# Altium schematic sheet RELAY.SchDoc
size A
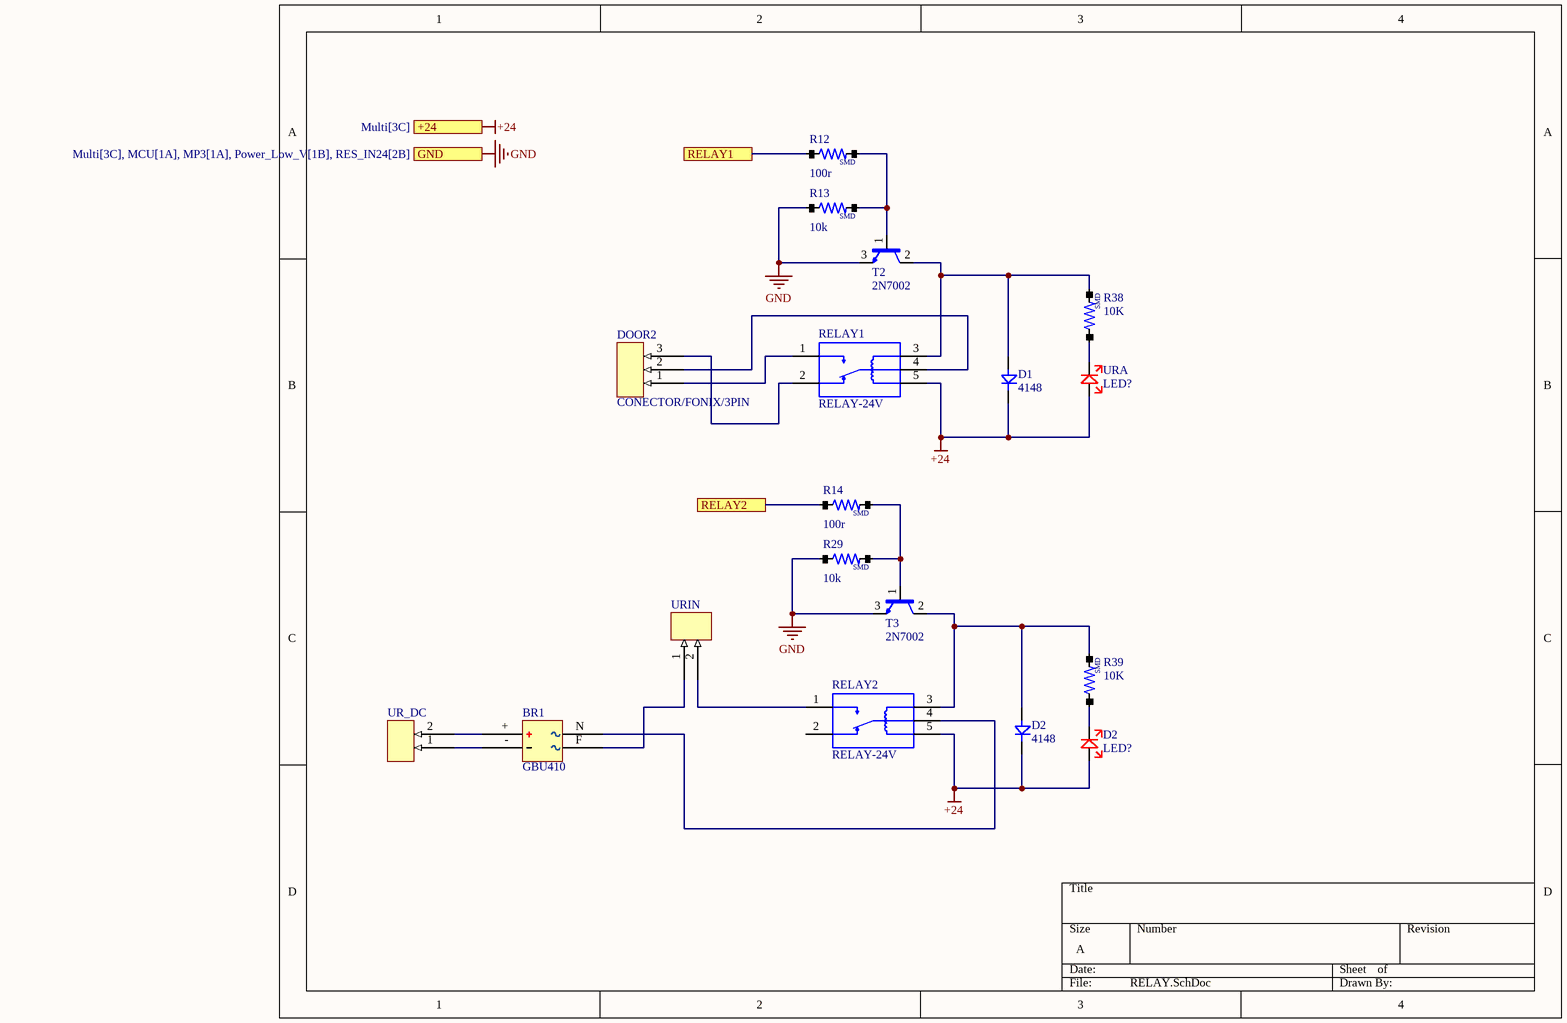
[diagram p0: RELAY.SchDoc]

## Parts
(Parts that share a designator on the sheet are numbered #1, #2 ... from top to bottom, then left to right.)
BR1  GBU410  [BRIDGE_GBU410]
D1  4148  [mini_melf]
D2#1  4148  [mini_melf]
D2#2  LED?  [LED/0805]
DOOR2  CONECTOR/FONIX/3PIN  [CONECTOR/FONIX/3PIN]
R12  100r  [RES/0603]
R13  10k  [RES/0603]
R14  100r  [RES/0603]
R29  10k  [RES/0603]
R38  10K  [RES/0603]
R39  10K  [RES/0603]
RELAY1  RELAY-24V  [RELAY-5V]
RELAY2  RELAY-24V  [RELAY-5V]
T2  2N7002  [SOT23]
T3  2N7002  [SOT23]
UR_DC  (no value)  [CONECTOR/FONIX/2PIN]
URA  LED?  [LED/0805]
URIN  (no value)  [CONECTOR/FONIX/2PIN]

## Ports
+24 (see Multi[3C]), GND (see Multi[3C], MCU[1A], MP3[1A], Power_Low_V[1B], RES_IN24[2B]), RELAY1, RELAY2

## Nets
+24: D1.K D2#1.K D2#2.A RELAY1.5(C2) RELAY2.5(C2) URA.A ; port +24
GND: R13.1 R29.1 T2.3(E) T3.3(E) ; port GND
RELAY1: R12.1 ; port RELAY1
RELAY2: R14.1 ; port RELAY2
NetBR1_+: BR1.+ UR_DC.2
NetBR1_-: BR1.- UR_DC.1
NetBR1_F: BR1.F URIN.1
NetBR1_N: BR1.N RELAY2.4(C)
NetD1_A: D1.A R38.2 RELAY1.3(C1) T2.2(C)
NetD2#1_A: D2#1.A R39.2 RELAY2.3(C1) T3.2(C)
NetD2#2_K: D2#2.K R39.1
NetDOOR2_1: DOOR2.1 RELAY1.1(NO)
NetDOOR2_2: DOOR2.2 RELAY1.4(C)
NetDOOR2_3: DOOR2.3 RELAY1.2(NC)
NetR12_2: R12.2 R13.2 T2.1(B)
NetR14_2: R14.2 R29.2 T3.1(B)
NetR38_1: R38.1 URA.K
NetRELAY2_1: RELAY2.1(NO) URIN.2

Not connected (* = marked no-connect by the designer): RELAY2 2(NC)

## Notes on the sheet
- (in symbol RES/SMD) SMD

## Library data of the parts
BR1 = BRIDGE RECTIFIERS
D1 D2#1 = DIOD/RECTIFIERS
D2#2 URA = LED-1COLER
R12-R14 R29 R38 R39 = RES/SMD
RELAY1 RELAY2 = RELAY-5V
T2 T3 = NPN
UR_DC URIN = CONECTOR/FONIX/2PIN